# Altium schematic sheet Direct Digital IO.SchDoc: Motor Monitoring
size A3; Date: 2015/04/02; Author: QWER; Organization: NTUST EE-305; Address1: No.43, Sec. 4, Keelung Rd.; Address2: Da’an Dist.; Address3: Taipei 106; Address4: Taiwan (R.O.C.); Revision: 2.0; SheetNumber: 4; SheetTotal: 4
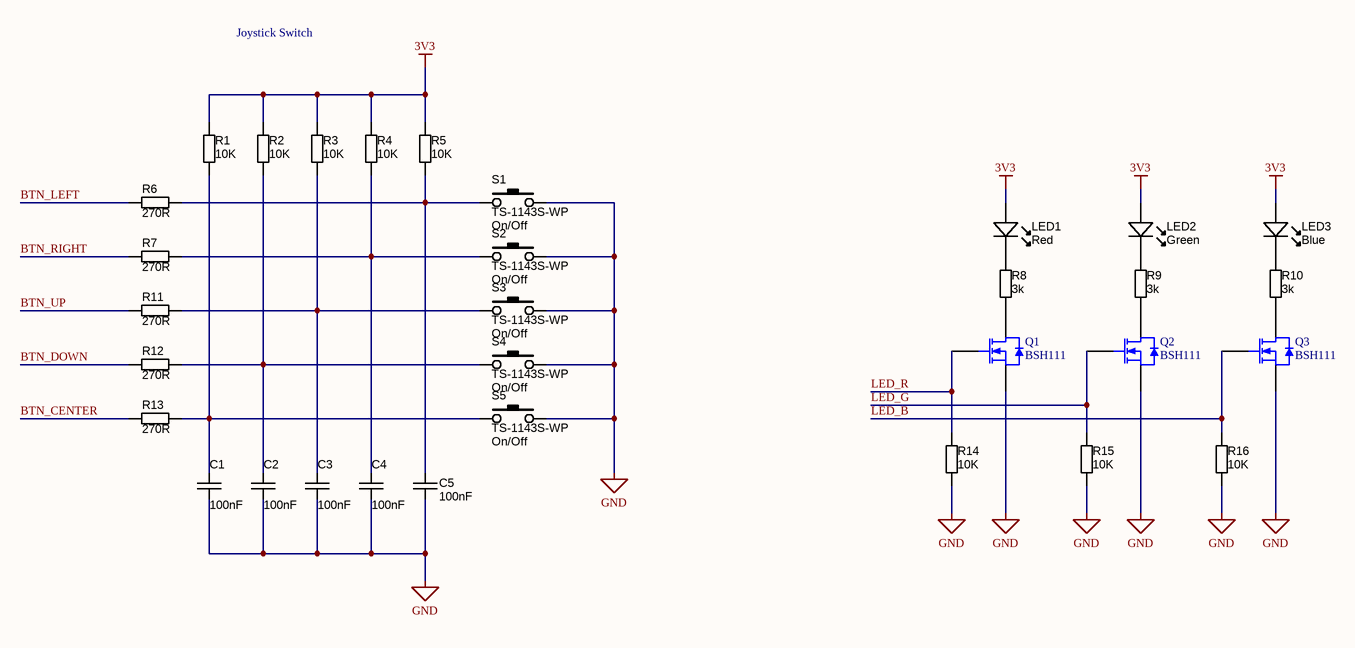
[diagram p0: Direct Digital IO.SchDoc]

## Parts
C1  value 100nF  [CAPC1005N]  (hidden comment: approved sub OK)
C2  value 100nF  [CAPC1005N]  (hidden comment: approved sub OK)
C3  value 100nF  [CAPC1005N]  (hidden comment: approved sub OK)
C4  value 100nF  [CAPC1005N]  (hidden comment: approved sub OK)
C5  value 100nF  [CAPC1005N]  (hidden comment: approved sub OK)
LED1  Color: Red  [LED-0603-GREEN]
LED2  Color: Green  [LED-0603-GREEN]
LED3  Blue  [LED-0603-GREEN]
Q1  BSH111  [SOT23_N]
Q2  BSH111  [SOT23_N]
Q3  BSH111  [SOT23_N]
R1  value 10K  [RESC1005N]  (hidden comment: Thick Film)
R2  value 10K  [RESC1005N]  (hidden comment: Thick Film)
R3  value 10K  [RESC1005N]  (hidden comment: Thick Film)
R4  value 10K  [RESC1005N]  (hidden comment: Thick Film)
R5  value 10K  [RESC1005N]  (hidden comment: Thick Film)
R6  value 270R  [RESC1005N]  (hidden comment: Thick Film)
R7  value 270R  [RESC1005N]  (hidden comment: Thick Film)
R8  value 3k  [RESC1005N]  (hidden comment: Thick Film)
R9  value 3k  [RESC1005N]  (hidden comment: Thick Film)
R10  value 3k  [RESC1005N]  (hidden comment: Thick Film)
R11  value 270R  [RESC1005N]  (hidden comment: Thick Film)
R12  value 270R  [RESC1005N]  (hidden comment: Thick Film)
R13  value 270R  [RESC1005N]  (hidden comment: Thick Film)
R14  value 10K  [RESC1005N]  (hidden comment: Thick Film)
R15  value 10K  [RESC1005N]  (hidden comment: Thick Film)
R16  value 10K  [RESC1005N]  (hidden comment: Thick Film)
S1  TS-1143S-WP  Function: On/Off  [TS-1143S]
S2  TS-1143S-WP  Function: On/Off  [TS-1143S]
S3  TS-1143S-WP  Function: On/Off  [TS-1143S]
S4  TS-1143S-WP  Function: On/Off  [TS-1143S]
S5  TS-1143S-WP  Function: On/Off  [TS-1143S]

## Nets
3V3: LED1.A LED2.A LED3.A R1.1 R2.1 R3.1 R4.1 R5.1
GND: C1.2 C2.2 C3.2 C4.2 C5.2 Q1.2(S) Q2.2(S) Q3.2(S) R14.1 R15.2 R16.2 S1.2 S2.2 S3.2 S4.2 S5.2
BTN_CENTER: R13.2
BTN_DOWN: R12.1
BTN_LEFT: R6.2
BTN_RIGHT: R7.1
BTN_UP: R11.1
LED_B: Q3.1(G) R16.1
LED_G: Q2.1(G) R15.1
LED_R: Q1.1(G) R14.2
NetC1_1: C1.1 R1.2 R13.1 S5.1
NetC2_1: C2.1 R2.2 R12.2 S4.1
NetC3_1: C3.1 R3.2 R11.2 S3.1
NetC4_1: C4.1 R4.2 R7.2 S2.1
NetC5_1: C5.1 R5.2 R6.1 S1.1
NetLED1_K: LED1.K R8.2
NetLED2_K: LED2.K R9.1
NetLED3_K: LED3.K R10.1
NetQ1_3: Q1.3(D) R8.1
NetQ2_3: Q2.3(D) R9.2
NetQ3_3: Q3.3(D) R10.2

## Notes on the sheet
- Joystick Switch
- Title
- Name
- Size:
- Revision:
- A3
- Date:
- Time:
- Sheet
- of

## Library data of the parts
C1-C5 = CAPC_100n_0805: Capacitor SMD Cer 100nF 10% 50V X7R 0805; Manufacturer 1: Kemet; Manufacturer Part Number 1: C0805C104K5RACTU; Tolerance: ?0%; Ratings: 50V; X7R; Material: ceramic; Package / Case: 0805 (2012 metric); Supplier 1: Digi-Key; Supplier Part Number 1: 399-1170-1-ND
LED1 = LED_SMD_Red_0805_6mcd: LED 0805 SMD Red 6mcd 621nm; Manufacturer 1: Lite-On Inc; Manufacturer Part Number 1: LTST-C171EKT; Material: GaAsP on GaP; Ratings: 6 mcd; 621 nm; Package / Case: 0805; Supplier 1: Digi-Key; Supplier Part Number 1: 160-1422-1-ND; Value: Red
LED2 = LED_SMD_Green_0805_6mcd: LED, 0805 SMD, Green; Manufacturer 1: LITE-ON; Manufacturer Part Number 1: LTST-C171GKT; Material: GaP; Ratings: 6 mcd; 569 nm; Package / Case: 0805; Supplier 1: Digi-Key; Supplier Part Number 1: 160-1423-1-ND; Value: Green
LED3 = LED_SMD_Blue_0805_100mcd: LED 0805 SMD Blue 100mcd 470nm; Manufacturer 1: Ligitek; Manufacturer Part Number 1: LG-170DBKZ-CT; Material: InGaN/GaN; Ratings: 100 mcd; 470 nm; Package / Case: 0805; Value: Blue; Color: Blue
Q1-Q3 = BSH103: N-channel Enhancement Mode MOSFET; Published: 17-Sep-2003; LatestRevisionDate: 12-Dec-2006; LatestRevisionNote: IPC-7351 Footprint Added.; DatasheetVersion: 11-Feb-1998; PackageVersion: May-1999; PackageReference: SOT23; Publisher: Altium Limited; PackageDescription: 3-Pin SOT-23 Package 0.95 mm Pitch, 2.3 mm Lead Span; ComponentLink1Description: Manufacturer Link; ComponentLink1URL: http://www.semiconductors.philips.com/; ComponentLink2Description: Datasheet; ComponentLink2URL: http://www.semiconductors.philips.com/acrobat/datasheets/BSH103_4.pdf
R1-R5 R8-R10 R14-R16 = RES_10K_0805_5%: Resistor SMD chip 10k Ohm 0.125W 5% 0805; Manufacturer 1: Yageo; Manufacturer Part Number 1: RC0805JR-0710KL; Ratings: 1/8 W; Tolerance: ?%; Package / Case: 0805 (2012 metric); Material: Thick Film; Supplier 1: Digi-Key; Supplier Part Number 1: 311-10KARCT-ND
R6 R7 R11-R13 = RES_330R_0402_5%: Resistor SMD chip 330 Ohm 0.063W 5% 0402; Manufacturer 1: Yageo; Manufacturer Part Number 1: RC0402JR-07330RL; Ratings: 1/16 W; Tolerance: ?%; Package / Case: 0402 (1005 Metric); Supplier 1: Digi-Key; Supplier Part Number 1: 311-330JRCT-ND; ComponentLink1URL: http://www.yageo.com/documents/recent/PYu-RC0402_51_RoHS_L_6.pdf; ComponentLink1Description: http://www.yageo.com/documents/recent/PYu-RC0402_51_RoHS_L_6.pdf
S1-S5 = SW_SMD_PB_4.3mm: Switch SMD Tact 4.3mm Stem; Manufacturer 1: Bond-Tact; Manufacturer Part Number 1: TS-1143S-WP-200; Package / Case: 6.5x6.5mm; 4.3mm stem